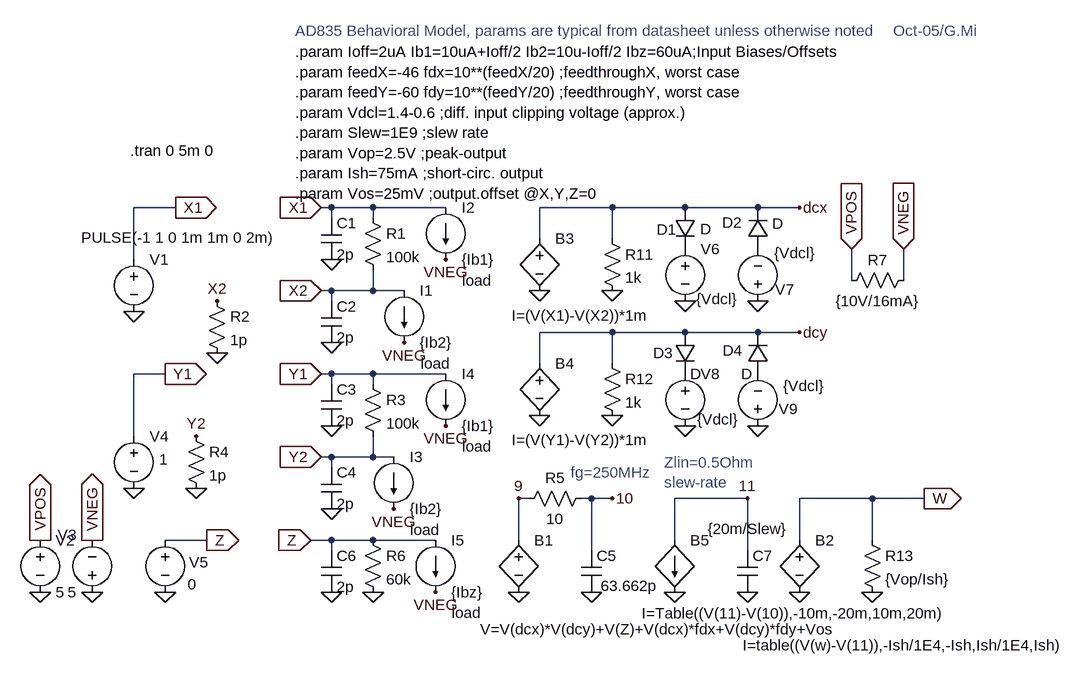
[diagram p0: schematic AD835_Behav_Model.asc]
AD835_Behav_Model.asc, the LTspice schematic file:
Version 4
SHEET 1 1812 1396
WIRE 80 736 80 656
WIRE 80 1008 80 912
WIRE 128 912 80 912
WIRE 144 656 80 656
WIRE 192 1168 128 1168
WIRE 384 656 368 656
WIRE 384 672 384 656
WIRE 384 784 368 784
WIRE 384 800 384 784
WIRE 384 912 368 912
WIRE 384 928 384 912
WIRE 384 1040 368 1040
WIRE 384 1056 384 1040
WIRE 384 1168 352 1168
WIRE 384 1184 384 1168
WIRE 448 656 384 656
WIRE 448 672 448 656
WIRE 448 784 384 784
WIRE 448 784 448 752
WIRE 448 912 384 912
WIRE 448 928 448 912
WIRE 448 1040 384 1040
WIRE 448 1040 448 1008
WIRE 448 1168 384 1168
WIRE 480 1040 448 1040
WIRE 496 784 448 784
WIRE 544 1168 448 1168
WIRE 560 656 448 656
WIRE 560 912 448 912
WIRE 672 1168 672 1104
WIRE 688 1104 672 1104
WIRE 704 704 704 656
WIRE 704 896 704 848
WIRE 784 1104 768 1104
WIRE 784 1184 784 1104
WIRE 816 656 704 656
WIRE 816 704 816 656
WIRE 816 848 704 848
WIRE 816 896 816 848
WIRE 816 1104 784 1104
WIRE 912 1168 912 1104
WIRE 928 656 816 656
WIRE 928 848 816 848
WIRE 1024 1104 912 1104
WIRE 1024 1184 1024 1104
WIRE 1040 656 928 656
WIRE 1040 848 928 848
WIRE 1104 656 1040 656
WIRE 1104 848 1040 848
WIRE 1104 1168 1104 1104
WIRE 1184 768 1184 720
WIRE 1216 1104 1104 1104
WIRE 1216 1168 1216 1104
WIRE 1264 768 1264 720
WIRE 1296 1104 1216 1104
FLAG 368 656 X1
IOPIN 368 656 In
FLAG 384 736 0
FLAG 368 784 X2
IOPIN 368 784 In
FLAG 384 864 0
FLAG 368 912 Y1
IOPIN 368 912 In
FLAG 384 992 0
FLAG 368 1040 Y2
IOPIN 368 1040 In
FLAG 384 1120 0
FLAG 672 1248 0
FLAG 1104 1248 0
FLAG 672 1104 9
FLAG 784 1248 0
FLAG 816 1104 10
FLAG 352 1168 Z
IOPIN 352 1168 In
FLAG 448 1248 0
FLAG 384 1248 0
FLAG 1296 1104 W
IOPIN 1296 1104 Out
FLAG 1184 720 VPOS
IOPIN 1184 720 In
FLAG 1264 720 VNEG
IOPIN 1264 720 In
FLAG 80 816 0
FLAG 16 1248 0
FLAG -64 1248 0
FLAG -64 1168 VPOS
IOPIN -64 1168 Out
FLAG 16 1168 VNEG
IOPIN 16 1168 Out
FLAG 144 656 X1
IOPIN 144 656 Out
FLAG 128 912 Y1
IOPIN 128 912 Out
FLAG 80 1088 0
FLAG 128 1248 0
FLAG 192 1168 Z
IOPIN 192 1168 Out
FLAG 704 784 0
FLAG 1104 656 dcx
FLAG 816 784 0
FLAG 928 800 0
FLAG 1040 800 0
FLAG 704 976 0
FLAG 1104 848 dcy
FLAG 816 976 0
FLAG 928 992 0
FLAG 1040 992 0
FLAG 176 1088 0
FLAG 208 880 0
FLAG 208 800 X2
FLAG 176 1008 Y2
FLAG 560 736 VNEG
FLAG 496 864 VNEG
FLAG 560 992 VNEG
FLAG 480 1120 VNEG
FLAG 544 1248 VNEG
FLAG 912 1248 0
FLAG 1024 1248 0
FLAG 1024 1104 11
FLAG 1216 1248 0
SYMBOL res 432 656 R0
SYMATTR InstName R1
SYMATTR Value 100k
SYMBOL res 432 912 R0
SYMATTR InstName R3
SYMATTR Value 100k
SYMBOL cap 368 672 R0
SYMATTR InstName C1
SYMATTR Value 2p
SYMBOL cap 368 800 R0
SYMATTR InstName C2
SYMATTR Value 2p
SYMBOL cap 368 928 R0
SYMATTR InstName C3
SYMATTR Value 2p
SYMBOL cap 368 1056 R0
SYMATTR InstName C4
SYMATTR Value 2p
SYMBOL bv 672 1152 R0
WINDOW 3 -59 153 Left 0
SYMATTR Value V=V(dcx)*V(dcy)+V(Z)+V(dcx)*fdx+V(dcy)*fdy+Vos
SYMATTR InstName B1
SYMBOL bv 1104 1152 R0
WINDOW 3 -87 178 Left 0
SYMATTR Value I=table((V(w)-V(11)),-Ish/1E4,-Ish,Ish/1E4,Ish)
SYMATTR InstName B2
SYMBOL res 672 1120 R270
WINDOW 0 32 56 VTop 0
WINDOW 3 0 56 VBottom 0
SYMATTR InstName R5
SYMATTR Value 10
SYMBOL cap 768 1184 R0
WINDOW 3 30 54 Left 0
SYMATTR Value 63.662p
SYMATTR InstName C5
SYMBOL res 432 1152 R0
SYMATTR InstName R6
SYMATTR Value 60k
SYMBOL cap 368 1184 R0
SYMATTR InstName C6
SYMATTR Value 2p
SYMBOL voltage 80 720 R0
WINDOW 3 -81 -18 Left 0
WINDOW 123 0 0 Left 0
WINDOW 39 0 0 Left 0
SYMATTR Value PULSE(-1 1 0 1m 1m 0 2m)
SYMATTR InstName V1
SYMBOL voltage -64 1152 R0
WINDOW 123 0 0 Left 0
WINDOW 39 0 0 Left 0
SYMATTR InstName V2
SYMATTR Value 5
SYMBOL voltage 16 1264 R180
WINDOW 0 24 104 Left 0
WINDOW 3 24 16 Left 0
WINDOW 123 0 0 Left 0
WINDOW 39 0 0 Left 0
SYMATTR InstName V3
SYMATTR Value 5
SYMBOL voltage 80 992 R0
WINDOW 3 39 52 Left 0
WINDOW 123 0 0 Left 0
WINDOW 39 0 0 Left 0
SYMATTR Value 1
SYMATTR InstName V4
SYMBOL voltage 128 1152 R0
WINDOW 0 37 50 Left 0
WINDOW 123 0 0 Left 0
WINDOW 39 0 0 Left 0
WINDOW 3 35 84 Left 0
SYMATTR InstName V5
SYMATTR Value 0
SYMBOL res 1168 784 R270
WINDOW 0 32 56 VTop 0
WINDOW 3 0 56 VBottom 0
SYMATTR InstName R7
SYMATTR Value {10V/16mA}
SYMBOL bv 704 688 R0
WINDOW 3 -43 134 Left 0
SYMATTR Value I=(V(X1)-V(X2))*1m
SYMATTR InstName B3
SYMBOL res 800 688 R0
SYMATTR InstName R11
SYMATTR Value 1k
SYMBOL diode 912 656 R0
WINDOW 0 -28 34 Left 0
WINDOW 3 39 33 Left 0
SYMATTR InstName D1
SYMBOL diode 1056 720 R180
WINDOW 0 40 41 Left 0
WINDOW 3 -23 39 Left 0
SYMATTR InstName D2
SYMBOL voltage 928 704 R0
WINDOW 3 17 93 Left 0
WINDOW 123 0 0 Left 0
WINDOW 39 0 0 Left 0
SYMATTR Value {Vdcl}
SYMATTR InstName V6
SYMBOL voltage 1040 816 R180
WINDOW 0 -56 34 Left 0
WINDOW 3 -88 90 Left 0
WINDOW 123 0 0 Left 0
WINDOW 39 0 0 Left 0
SYMATTR InstName V7
SYMATTR Value {Vdcl}
SYMBOL bv 704 880 R0
WINDOW 3 -43 134 Left 0
SYMATTR Value I=(V(Y1)-V(Y2))*1m
SYMATTR InstName B4
SYMBOL res 800 880 R0
SYMATTR InstName R12
SYMATTR Value 1k
SYMBOL diode 912 848 R0
WINDOW 0 -33 32 Left 0
SYMATTR InstName D3
SYMBOL diode 1056 912 R180
WINDOW 0 39 36 Left 0
WINDOW 3 24 0 Left 0
SYMATTR InstName D4
SYMBOL voltage 928 896 R0
WINDOW 3 19 86 Left 0
WINDOW 123 0 0 Left 0
WINDOW 39 0 0 Left 0
SYMATTR Value {Vdcl}
SYMATTR InstName V8
SYMBOL voltage 1040 1008 R180
WINDOW 0 -61 42 Left 0
WINDOW 3 -102 77 Left 0
WINDOW 123 0 0 Left 0
WINDOW 39 0 0 Left 0
SYMATTR InstName V9
SYMATTR Value {Vdcl}
SYMBOL res 192 784 R0
SYMATTR InstName R2
SYMATTR Value 1p
SYMBOL res 160 992 R0
SYMATTR InstName R4
SYMATTR Value 1p
SYMBOL load2 496 784 R0
WINDOW 123 0 0 Left 0
WINDOW 39 25 112 Left 0
SYMATTR SpiceLine load
SYMATTR InstName I1
SYMATTR Value {Ib2}
SYMBOL load2 560 656 R0
WINDOW 123 0 0 Left 0
WINDOW 39 25 112 Left 0
SYMATTR SpiceLine load
SYMATTR InstName I2
SYMATTR Value {Ib1}
SYMBOL load2 480 1040 R0
WINDOW 123 0 0 Left 0
WINDOW 39 25 112 Left 0
SYMATTR SpiceLine load
SYMATTR InstName I3
SYMATTR Value {Ib2}
SYMBOL load2 560 912 R0
WINDOW 123 0 0 Left 0
WINDOW 39 25 112 Left 0
SYMATTR SpiceLine load
SYMATTR InstName I4
SYMATTR Value {Ib1}
SYMBOL load2 544 1168 R0
WINDOW 123 0 0 Left 0
WINDOW 39 25 112 Left 0
SYMATTR SpiceLine load
SYMATTR InstName I5
SYMATTR Value {Ibz}
SYMBOL bi 912 1168 R0
WINDOW 3 -51 113 Left 0
SYMATTR Value I=Table((V(11)-V(10)),-10m,-20m,10m,20m)
SYMATTR InstName B5
SYMBOL cap 1008 1184 R0
WINDOW 3 -45 -33 Left 0
SYMATTR Value {20m/Slew}
SYMATTR InstName C7
SYMBOL res 1200 1152 R0
SYMATTR InstName R13
SYMATTR Value {Vop/Ish}
TEXT 74 568 Left 0 !.tran 0 5m 0
TEXT 328 416 Left 0 !.param Ioff=2uA Ib1=10uA+Ioff/2 Ib2=10u-Ioff/2 Ibz=60uA;Input Biases/Offsets\n.param feedX=-46 fdx=10**(feedX/20) ;feedthroughX, worst case\n.param feedY=-60 fdy=10**(feedY/20) ;feedthroughY, worst case\n.param Vdcl=1.4-0.6 ;diff. input clipping voltage (approx.)\n.param Slew=1E9 ;slew rate\n.param Vop=2.5V ;peak-output\n.param Ish=75mA ;short-circ. output\n.param Vos=25mV ;output.offset @X,Y,Z=0
TEXT 752 1064 Left 0 ;fg=250MHz
TEXT 896 1048 Left 0 ;Zlin=0.5Ohm\nslew-rate
TEXT 328 384 Left 0 ;AD835 Behavioral Model, params are typical from datasheet unless otherwise noted
TEXT 1248 384 Left 0 ;Oct-05/G.Mi

The netlist it stands for:
* AD835_Behav_Model.asc
R1 X1 X2 100k
R3 Y1 Y2 100k
C1 X1 0 2p
C2 X2 0 2p
C3 Y1 0 2p
C4 Y2 0 2p
B1 9 0 V=V(dcx)*V(dcy)+V(Z)+V(dcx)*fdx+V(dcy)*fdy+Vos
B2 W 0 I=table((V(w)-V(11)),-Ish/1E4,-Ish,Ish/1E4,Ish)
R5 9 10 10
C5 10 0 63.662p
R6 Z 0 60k
C6 Z 0 2p
V1 X1 0 PULSE(-1 1 0 1m 1m 0 2m)
V2 VPOS 0 5
V3 0 VNEG 5
V4 Y1 0 1
V5 Z 0 0
R7 VPOS VNEG {10V/16mA}
B3 dcx 0 I=(V(X1)-V(X2))*1m
R11 dcx 0 1k
D1 dcx P001 D
D2 P002 dcx D
V6 P001 0 {Vdcl}
V7 0 P002 {Vdcl}
B4 dcy 0 I=(V(Y1)-V(Y2))*1m
R12 dcy 0 1k
D3 dcy P003 D
D4 P004 dcy D
V8 P003 0 {Vdcl}
V9 0 P004 {Vdcl}
R2 X2 0 1p
R4 Y2 0 1p
I1 X2 VNEG {Ib2} load
I2 X1 VNEG {Ib1} load
I3 Y2 VNEG {Ib2} load
I4 Y1 VNEG {Ib1} load
I5 Z VNEG {Ibz} load
B5 11 0 I=Table((V(11)-V(10)),-10m,-20m,10m,20m)
C7 11 0 {20m/Slew}
R13 W 0 {Vop/Ish}
.model D D
.lib standard.dio
.tran 0 5m 0
.param Ioff=2uA Ib1=10uA+Ioff/2 Ib2=10u-Ioff/2 Ibz=60uA;Input Biases/Offsets
.param feedX=-46 fdx=10**(feedX/20) ;feedthroughX, worst case
.param feedY=-60 fdy=10**(feedY/20) ;feedthroughY, worst case
.param Vdcl=1.4-0.6 ;diff. input clipping voltage (approx.)
.param Slew=1E9 ;slew rate
.param Vop=2.5V ;peak-output
.param Ish=75mA ;short-circ. output
.param Vos=25mV ;output.offset @X,Y,Z=0
* fg=250MHz
* Zlin=0.5Ohm
* slew-rate
* AD835 Behavioral Model, params are typical from datasheet unless otherwise noted
* Oct-05/G.Mi
.backanno
.end